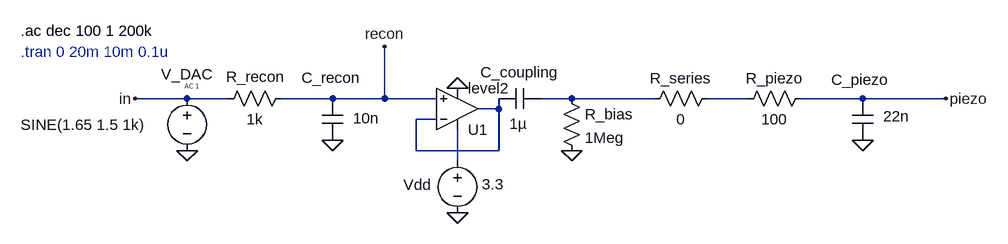
[diagram p0: schematic nucleo_output_stage_full.asc]
nucleo_output_stage_full.asc, the LTspice schematic file:
Version 4.1
SHEET 1 3836 1336
WIRE 1216 128 1136 128
WIRE 1280 128 1216 128
WIRE 1440 128 1360 128
WIRE 1520 128 1520 48
WIRE 1520 128 1440 128
WIRE 1600 128 1520 128
WIRE 1808 128 1760 128
WIRE 1936 128 1808 128
WIRE 2080 128 2016 128
WIRE 2256 128 2160 128
WIRE 2384 128 2256 128
WIRE 1696 144 1696 128
WIRE 1696 144 1664 144
WIRE 1600 160 1568 160
WIRE 1568 208 1568 160
WIRE 1696 208 1696 144
WIRE 1696 208 1568 208
WIRE 1632 224 1632 176
FLAG 1216 208 0
FLAG 1136 128 in
FLAG 2384 128 piezo
FLAG 1632 112 0
FLAG 1440 192 0
FLAG 2256 192 0
FLAG 1632 304 0
FLAG 1808 208 0
FLAG 1520 48 recon
SYMBOL voltage 1216 112 R0
WINDOW 123 -4 -3 Left 0
WINDOW 39 24 124 Left 2
WINDOW 0 -40 -21 Left 2
WINDOW 3 -256 56 Left 2
SYMATTR Value2 AC 1
SYMATTR InstName V_DAC
SYMATTR Value SINE(1.65 1.5 1k)
SYMBOL Opamps\\UniversalOpamp2 1632 144 M180
SYMATTR InstName U1
SYMATTR Value level2
SYMATTR Value2 Avol=31.6k GBW=8.2Meg Slew=4.7Meg
SYMATTR SpiceLine Ilimit=25m Rail=0 Vos=1m Rin=500Meg
SYMBOL res 2032 112 R90
WINDOW 0 0 56 VBottom 2
WINDOW 3 32 56 VTop 2
SYMATTR InstName R_series
SYMATTR Value 0
SYMBOL cap 1456 128 M0
WINDOW 0 -28 -32 Left 2
WINDOW 3 -56 30 Left 2
SYMATTR InstName C_recon
SYMATTR Value 10n
SYMBOL cap 1760 112 R90
WINDOW 0 -9 32 VBottom 2
WINDOW 3 39 34 VTop 2
SYMATTR InstName C_coupling
SYMATTR Value 1µ
SYMATTR SpiceLine Rser=1
SYMBOL res 2176 112 R90
WINDOW 0 0 56 VBottom 2
WINDOW 3 32 56 VTop 2
SYMATTR InstName R_piezo
SYMATTR Value 100
SYMBOL cap 2272 128 M0
WINDOW 0 -24 -29 Left 2
WINDOW 3 -56 27 Left 2
SYMATTR InstName C_piezo
SYMATTR Value 22n
SYMBOL voltage 1632 208 R0
WINDOW 0 -83 53 Left 2
WINDOW 3 38 52 Left 2
WINDOW 123 0 0 Left 0
WINDOW 39 0 0 Left 0
SYMATTR InstName Vdd
SYMATTR Value 3.3
SYMBOL res 1376 112 R90
WINDOW 0 -2 54 VBottom 2
WINDOW 3 32 56 VTop 2
SYMATTR InstName R_recon
SYMATTR Value 1k
SYMBOL res 1792 112 R0
SYMATTR InstName R_bias
SYMATTR Value 1Meg
TEXT 960 24 Left 2 !.ac dec 100 1 200k
TEXT 960 56 Left 2 ;.tran 0 20m 10m 0.1u

The netlist it stands for:
* nucleo_output_stage_full.asc
V_DAC in 0 SINE(1.65 1.5 1k) AC 1
X§U1 recon N003 N004 0 N003 level.2 level2 Avol=31.6k GBW=8.2Meg Slew=4.7Meg Ilimit=25m Rail=0 Vos=1m Rin=500Meg en=0 enk=0 in=0 ink=0 Rin=500Meg  ; pins IN+ IN- V+ V- OUT
R_series N002 N001 0
C_recon recon 0 10n
C_coupling N001 N003 1µ Rser=1
R_piezo piezo N002 100
C_piezo piezo 0 22n
Vdd N004 0 3.3
R_recon recon in 1k
R_bias N001 0 1Meg
.ac dec 100 1 200k
* .tran 0 20m 10m 0.1u
.lib UniversalOpamps2.sub
.backanno
.end